# EAGLE design teensy36-audio-tft (EAGLE 8.0.2)
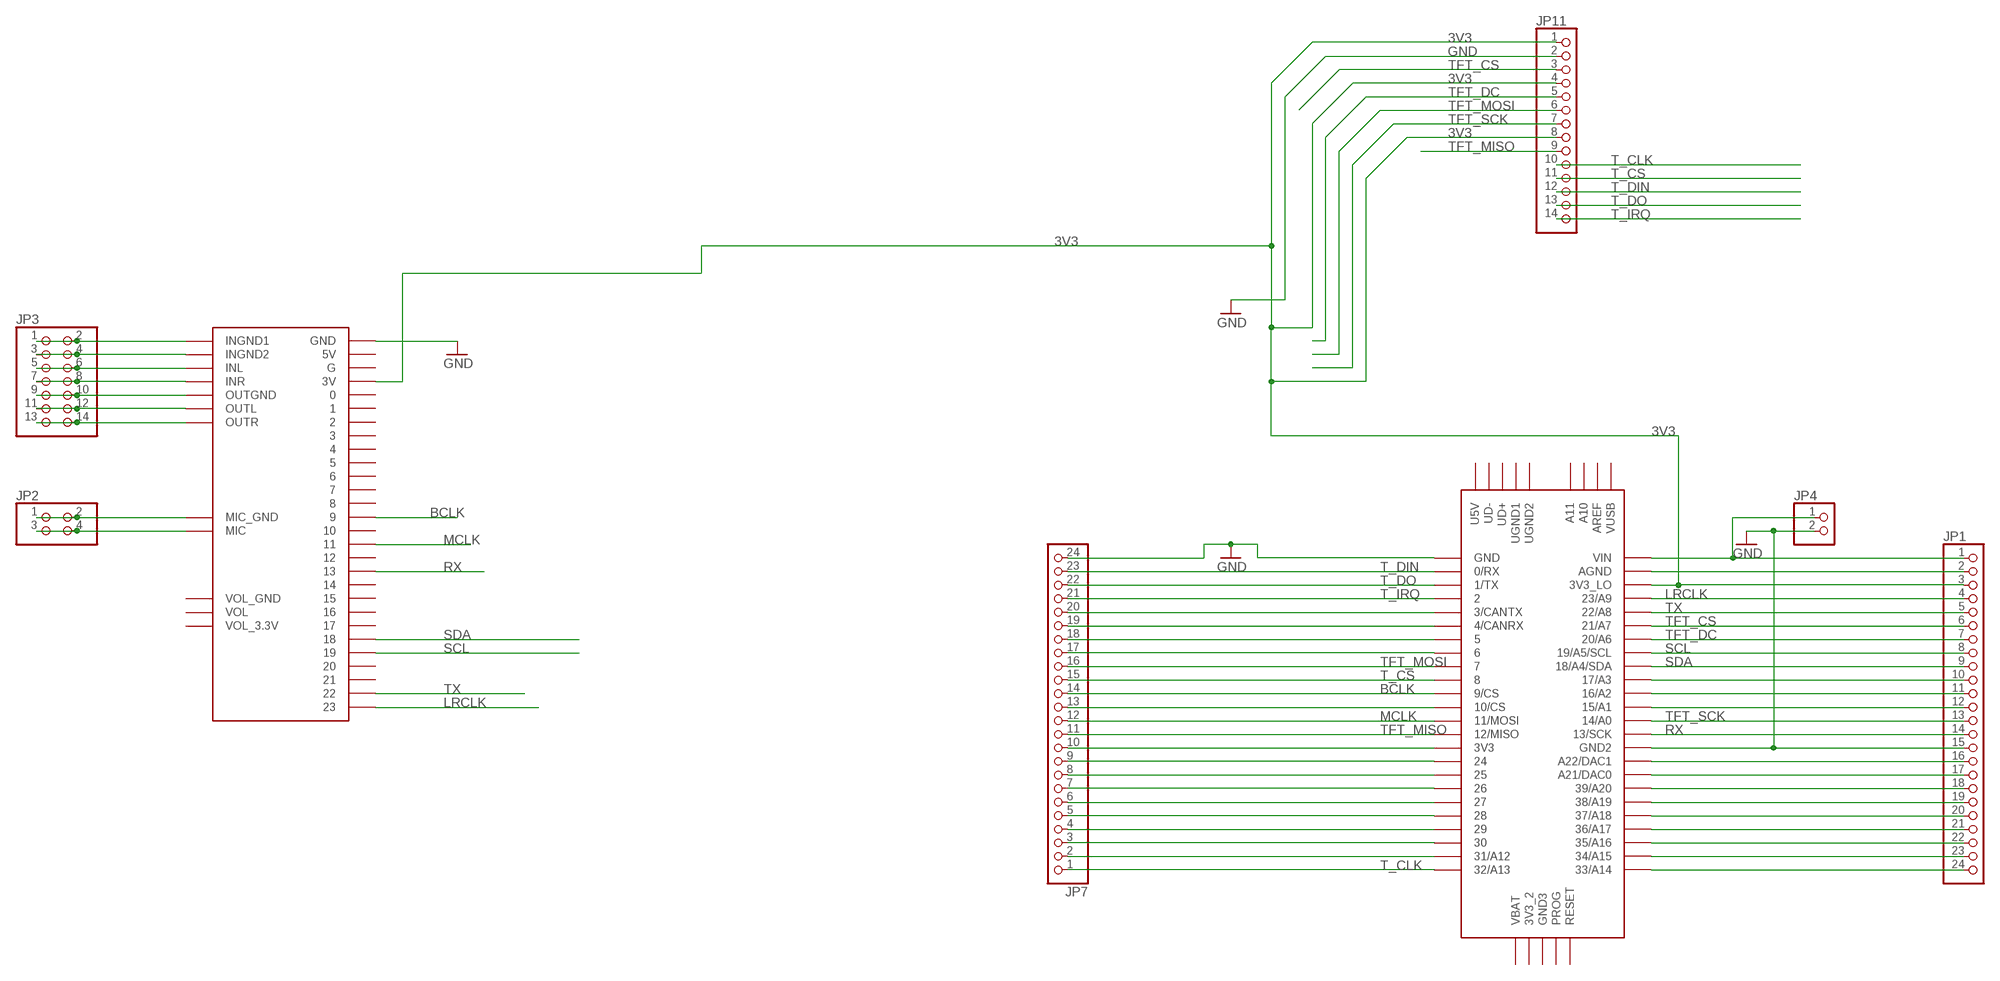
[diagram p0: schematic, sheet 1]

## Parts
JP1  PINHD-1X24  [1X24]
JP2  PINHD-2X2  [2X02]
JP3  PINHD-2X7  [2X07]
JP4  PINHD-1X2  [1X02]
JP7  PINHD-1X24  [1X24]
JP11  PINHD-1X14  [1X14]
U$2  AUDIOSHIELD  [AUDIOSHIELD]
U$3  TEENSY_3.5/3.6  [TEENSY_3.5/3.6]

## Nets
3V3: JP1.3 JP11.1 JP11.4 JP11.8 U$2.3V U$3.3V3_LO
BCLK: JP7.14 U$2.9 U$3.9/CS
GND: JP1.15 JP4.2 JP7.24 JP11.2 U$2.GND U$3.GND U$3.GND2
LRCLK: JP1.4 U$2.23 U$3.23/A9
MCLK: JP7.12 U$2.11 U$3.11/MOSI
N$1: JP2.1 JP2.2 U$2.GND_MIC(MIC_GND)
N$2: JP1.1 JP4.1 U$3.VIN
N$7: JP7.20 U$3.3/CANTX
N$8: JP7.19 U$3.4/CANRX
N$9: JP7.18 U$3.5
N$10: JP2.3 JP2.4 U$2.MIC
N$11: JP3.1 JP3.2 U$2.INGND1
N$12: JP3.3 JP3.4 U$2.INGND2
N$13: JP3.5 JP3.6 U$2.INL
N$14: JP3.7 JP3.8 U$2.INR
N$15: JP3.9 JP3.10 U$2.OUTGND
N$16: JP3.11 JP3.12 U$2.OUTL
N$17: JP3.13 JP3.14 U$2.OUTR
N$18: JP7.17 U$3.6
N$22: JP7.13 U$3.10/CS
N$25: JP7.10 U$3.3V3
N$26: JP7.9 U$3.24
N$27: JP7.8 U$3.25
N$28: JP7.7 U$3.26
N$29: JP7.6 U$3.27
N$30: JP7.5 U$3.28
N$31: JP7.4 U$3.29
N$32: JP7.3 U$3.30
N$33: JP7.2 U$3.31/A12
N$36: JP1.2 U$3.AGND
N$44: JP1.10 U$3.17/A3
N$45: JP1.11 U$3.16/A2
N$46: JP1.12 U$3.15/A1
N$50: JP1.16 U$3.A22/DAC1
N$51: JP1.17 U$3.21/DAC0(A21/DAC0)
N$52: JP1.18 U$3.39/A20
N$53: JP1.19 U$3.38/A19
N$54: JP1.20 U$3.37/A18
N$55: JP1.21 U$3.36/A17
N$56: JP1.22 U$3.35/A16
N$57: JP1.23 U$3.34/A15
N$58: JP1.24 U$3.33/A14
RX: JP1.14 U$2.13 U$3.13/SCK
SCL: JP1.8 U$2.19 U$3.19/A5/SCL
SDA: JP1.9 U$2.18 U$3.18/A4/SDA
T_CLK: JP7.1 JP11.10 U$3.32/A13
T_CS: JP7.15 JP11.11 U$3.8
T_DIN: JP7.23 JP11.12 U$3.0/RX
T_DO: JP7.22 JP11.13 U$3.1/TX
T_IRQ: JP7.21 JP11.14 U$3.2
TFT_CS: JP1.6 JP11.3 U$3.21/A7
TFT_DC: JP1.7 JP11.5 U$3.20/A6
TFT_MISO: JP7.11 JP11.9
TFT_MOSI: JP7.16 JP11.6 U$3.7
TFT_SCK: JP1.13 JP11.7 U$3.14/A0
TX: JP1.5 U$2.22 U$3.22/A8
Unconnected: U$2.0 U$2.1 U$2.2 U$2.3 U$2.4 U$2.5 U$2.5V U$2.6 U$2.7 U$2.8 U$2.10 U$2.12 U$2.14 U$2.15 U$2.16 U$2.17 U$2.20 U$2.21 U$2.G U$2.VOL U$2.VOL_3.3V U$2.VOL_GND U$3.3V3_2 U$3.12/MISO U$3.A10 U$3.A11 U$3.AREF U$3.GND3 U$3.PROG U$3.RESET U$3.U5V U$3.UD+ U$3.UD- U$3.UGND1 U$3.UGND2 U$3.VBAT U$3.VUSB

## Library data of the parts
JP1 JP7 = pinhead:PINHD-1X24: PIN HEADER
JP2 = pinhead:PINHD-2X2: PIN HEADER
JP3 = pinhead:PINHD-2X7: PIN HEADER
JP4 = pinhead:PINHD-1X2: PIN HEADER
JP11 = pinhead:PINHD-1X14: PIN HEADER
U$2 = Teensy_Audioshield:AUDIOSHIELD: Teensy 3 Audioshield by PJRC.COM
U$3 = JC_Teensy356:TEENSY_3.5/3.6

## Board
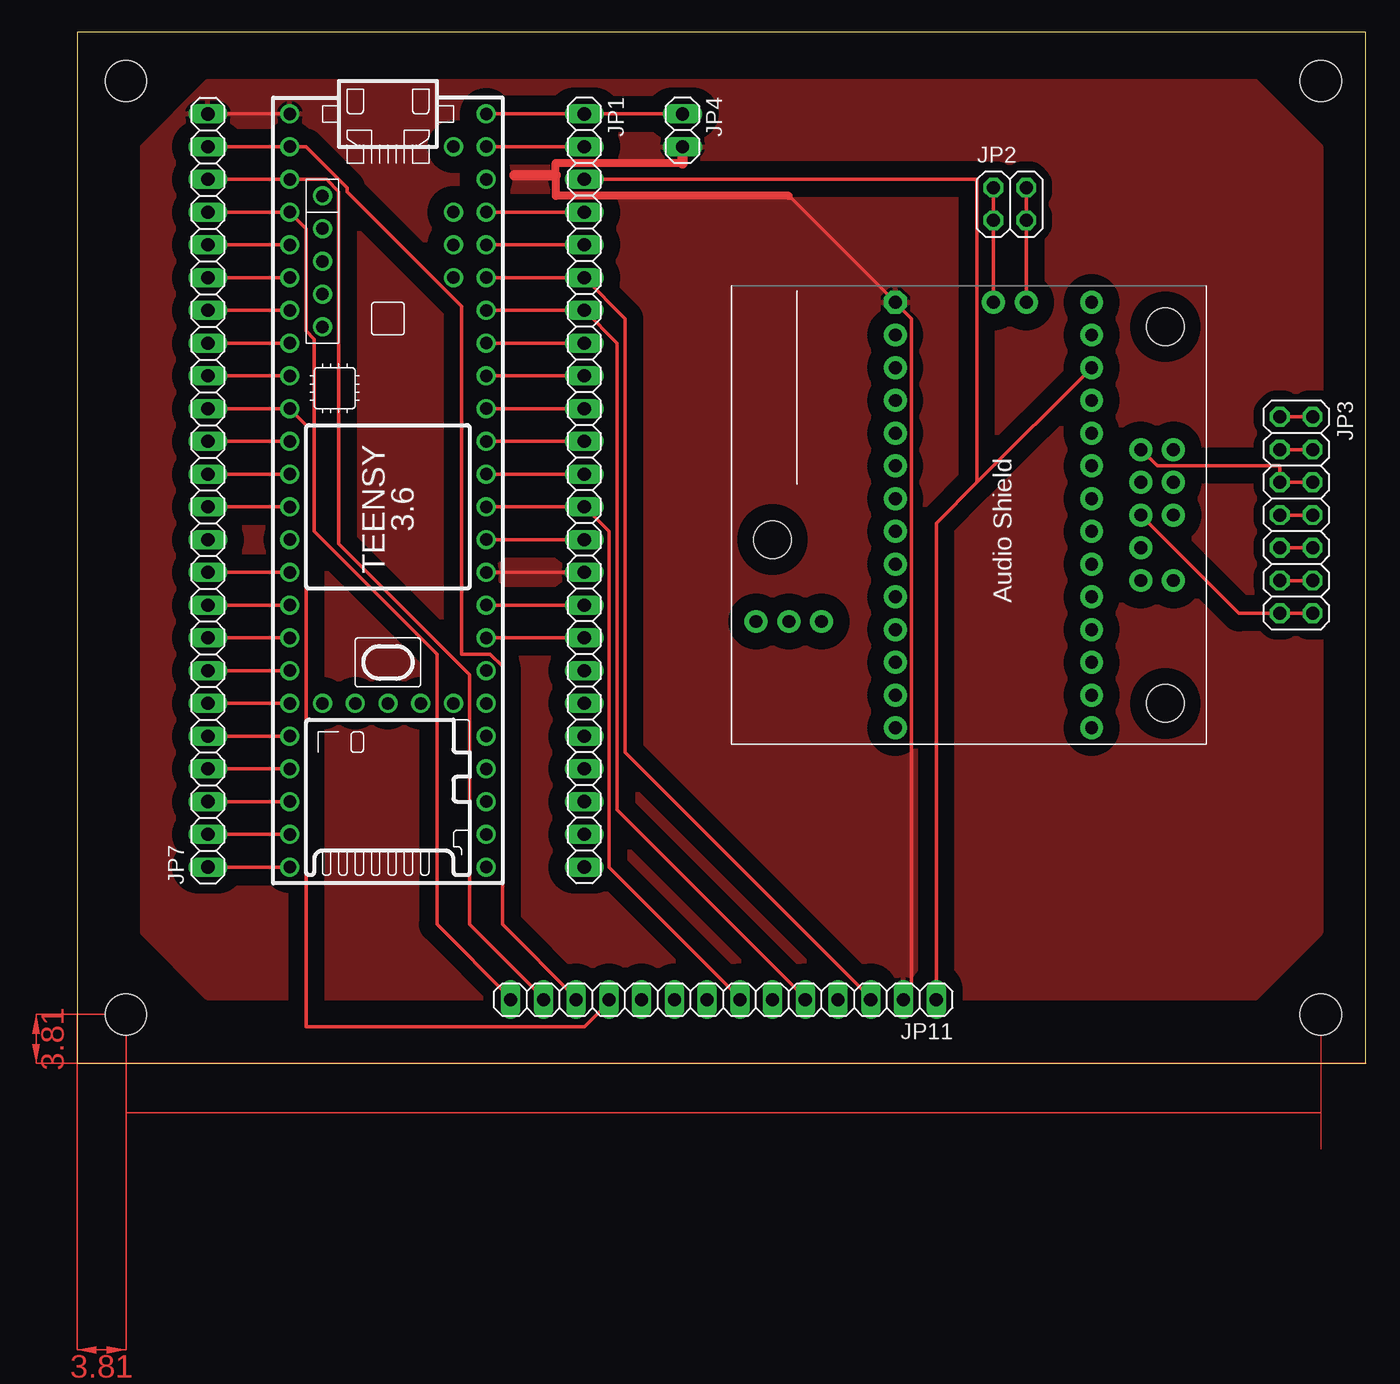
[diagram p1: board, top side]
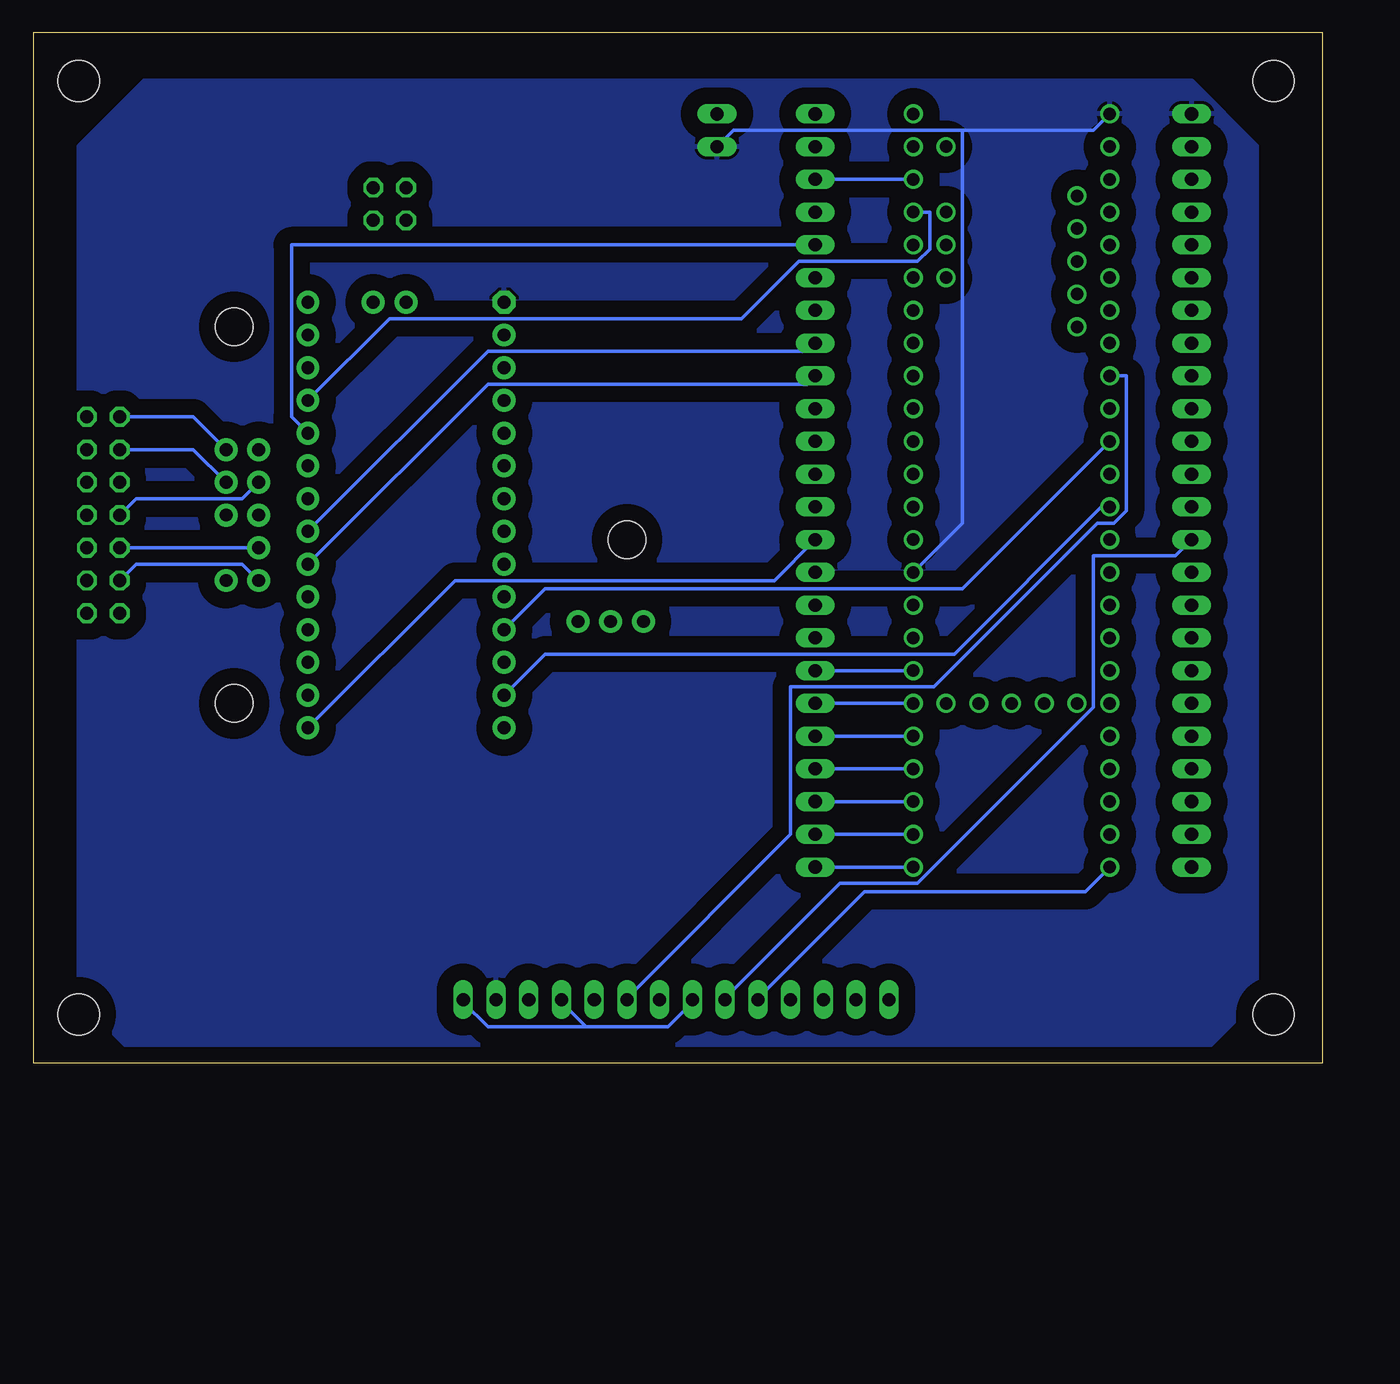
[diagram p2: board, bottom side, seen from below]

Size 100 x 80 mm. Coordinates in mm from the lower left corner, seen from the top.
Outline: 0,0 100,0 100,80 0,80 0,0
Copper layers (1*16): Top 0.035mm / dielectric 1.5mm / Bottom 0.035mm
Design rules "default": minimum track width 10mil, minimum drill 24mil, track to track 8mil, track to pad 8mil, pad to pad 8mil, via to via 8mil, smd to smd 8mil, copper to edge 40mil, drill to drill 8mil, minimum pad ring 10mil, minimum via ring 8mil, stop-mask expansion 4mil, vias tented up to drill 0mil, thermal gap 10mil
Holes 3.2 mm at 3.81,76.2 3.81,3.81 96.52,76.2 96.52,3.81

### Footprints (pad centres in the part's own frame; a part is rotated, then mirrored left to right if it is on the bottom)
1X24 = drill 1.016 long: 1 -29.21,0; 2 -26.67,0; 3 -24.13,0; 4 -21.59,0; 5 -19.05,0; 6 -16.51,0; 7 -13.97,0; 8 -11.43,0; 9 -8.89,0; 10 -6.35,0; 11 -3.81,0; 12 -1.27,0; 13 1.27,0; 14 3.81,0; 15 6.35,0; 16 8.89,0; 17 11.43,0; 18 13.97,0; 19 16.51,0; 20 19.05,0; 21 21.59,0; 22 24.13,0; 23 26.67,0; 24 29.21,0
2X02 = drill 1.016 octagon: 1 -1.27,-1.27; 2 -1.27,1.27; 3 1.27,-1.27; 4 1.27,1.27
2X07 = drill 1.016 octagon: 1 -7.62,-1.27; 2 -7.62,1.27; 3 -5.08,-1.27; 4 -5.08,1.27; 5 -2.54,-1.27; 6 -2.54,1.27; 7 0,-1.27; 8 0,1.27; 9 2.54,-1.27; 10 2.54,1.27; 11 5.08,-1.27; 12 5.08,1.27; 13 7.62,-1.27; 14 7.62,1.27
1X02 = drill 1.016 long: 1 -1.27,0; 2 1.27,0
1X14 = drill 1.016 long: 1 -16.51,0; 2 -13.97,0; 3 -11.43,0; 4 -8.89,0; 5 -6.35,0; 6 -3.81,0; 7 -1.27,0; 8 1.27,0; 9 3.81,0; 10 6.35,0; 11 8.89,0; 12 11.43,0; 13 13.97,0; 14 16.51,0
AUDIOSHIELD = drill 1 pad 1.778: 0 -13.97,-5.08; 1 -11.43,-5.08; 2 -8.89,-5.08; 3 -6.35,-5.08; 3V -11.43,10.16; 4 -3.81,-5.08; 5 -1.27,-5.08; 5V -16.51,10.16; 6 1.27,-5.08; 7 3.81,-5.08; 8 6.35,-5.08; 9 8.89,-5.08; 10 11.43,-5.08; 11 13.97,-5.08; 12 16.51,-5.08; 13 16.51,10.16; 14 13.97,10.16; 15 11.43,10.16; 16 8.89,10.16; 17 6.35,10.16; 18 3.81,10.16; 19 1.27,10.16; 20 -1.27,10.16; 21 -3.81,10.16; 22 -6.35,10.16; 23 -8.89,10.16; G -13.97,10.16; GND_MIC -16.51,2.54; INGND1 -5.08,16.51; INGND2 -2.54,16.51; INL -5.08,13.97; INR -2.54,13.97; MIC -16.51,5.08; OUTGND 2.54,13.97; OUTL 5.08,13.97; OUTR 0,13.97; UNUSED1 0,16.51; UNUSED2 5.08,16.51; VOL 8.255,-13.335; VOL_3.3V 8.255,-15.875; VOL_GND 8.255,-10.795 | drill 1 pad 1.778 octagon: GND -16.51,-5.08 | hole 2.921: 1.905,-14.605; -14.605,15.875; 14.605,15.875
TEENSY_3.5/3.6 = drill 0.965: 0/RX -25.4,-7.62; 1/TX -22.86,-7.62; 2 -20.32,-7.62; 3/CANTX -17.78,-7.62; 3V3 7.62,-7.62; 3V3_2 17.78,-2.54; 3V3_LO -22.86,7.62; 4/CANRX -15.24,-7.62; 5 -12.7,-7.62; 6 -10.16,-7.62; 7 -7.62,-7.62; 8 -5.08,-7.62; 9/CS -2.54,-7.62; 10/CS 0,-7.62; 11/MOSI 2.54,-7.62; 12/MISO 5.08,-7.62; 13/SCK 5.08,7.62; 14/A0 2.54,7.62; 15/A1 0,7.62; 16/A2 -2.54,7.62; 17/A3 -5.08,7.62; 18/A4/SDA -7.62,7.62; 19/A5/SCL -10.16,7.62; 20/A6 -12.7,7.62; 21/A7 -15.24,7.62; 21/DAC0 12.7,7.62; 22/A8 -17.78,7.62; 23/A9 -20.32,7.62; 24 10.16,-7.62; 25 12.7,-7.62; 26 15.24,-7.62; 27 17.78,-7.62; 28 20.32,-7.62; 29 22.86,-7.62; 30 25.4,-7.62; 31/A12 27.94,-7.62; 32/A13 30.48,-7.62; 33/A14 30.48,7.62; 34/A15 27.94,7.62; 35/A16 25.4,7.62; 36/A17 22.86,7.62; 37/A18 20.32,7.62; 38/A19 17.78,7.62; 39/A20 15.24,7.62; A10 -17.78,5.08; A11 -15.24,5.08; A22/DAC1 10.16,7.62; AGND -25.4,7.62; AREF -20.32,5.08; GND -27.94,-7.62; GND2 7.62,7.62; GND3 17.78,0; PROG 17.78,2.54; RESET 17.78,5.08; U5V -21.59,-5.08; UD+ -16.51,-5.08; UD- -19.05,-5.08; UGND1 -13.97,-5.08; UGND2 -11.43,-5.08; VBAT 17.78,-5.08; VIN -27.94,7.62; VUSB -25.4,5.08

### Placement (x,y rotation side)
JP1  39.37,44.45 270 top
JP2  72.39,66.67 0 top
JP3  94.61,42.55 270 top
JP4  46.99,72.39 270 top
JP7  10.16,44.45 90 top
JP11  50.16,4.95 180 top
U$2  68.58,42.55 270 top
U$3  24.13,45.72 270 top

### Tracks (layer width: path | path; a pad name or v marks a point on that pad's centre or on a via)
3V3
  Top 0.254: 69.85,45.09 66.67,41.91 JP11.1 | 69.85,45.09 U$2.3V | JP1.3 69.85,68.58 69.85,45.09
  Bottom 0.254: JP1.3 U$3.3V3_LO | 57.15,2.86 50.8,2.86 48.9,4.76 JP11.8 | 57.15,2.86 59.05,4.76 JP11.4 | 57.15,2.86 64.77,2.86 66.67,4.76 JP11.1
BCLK
  Top 0.254: JP7.14 U$3.9/CS
  Bottom 0.254: U$2.9 60.33,36.83 27.94,36.83 U$3.9/CS
GND
  Top 0.254: JP11.2 64.14,5.08 64.77,5.71 64.77,57.78 U$2.GND 55.24,67.31 | JP1.15 U$3.GND2 | JP7.24 U$3.GND
  Top 0.406: 37.15,67.31 37.15,68.26 | 37.15,68.26 37.15,68.58 | 37.15,68.26 37.15,68.9
  Top 0.61: 55.24,67.31 37.15,67.31 37.15,68.26 37.15,68.58 37.15,68.9 37.15,69.85 46.99,69.85
  Top 0.813: JP4.2 46.99,69.85 | 37.15,68.9 33.97,68.9
  Bottom 0.254: JP4.2 45.72,72.39 27.94,72.39 | 27.94,72.39 17.78,72.39 U$3.GND | U$3.GND2 27.94,41.91 27.94,72.39
  pour Bottom (isolate 1.27): 5.08,71.12 10.16,76.2 91.44,76.2 96.52,71.12 96.52,10.16 96.52,5.08 91.44,0 10.16,0 5.08,5.08
  pour Top (isolate 1.27): 5.08,71.12 10.16,76.2 91.44,76.2 96.52,71.12 96.52,10.16 91.44,5.08 10.16,5.08 5.08,10.16
LRCLK
  Top 0.254: JP1.4 U$3.23/A9
  Bottom 0.254: U$2.23 72.39,57.78 45.09,57.78 40.64,62.23 31.43,62.23 30.48,63.18 30.48,66.04 U$3.23/A9
MCLK
  Top 0.254: JP7.12 U$3.11/MOSI
  Bottom 0.254: U$2.11 60.33,31.75 28.57,31.75 17.14,43.18 U$3.11/MOSI
N$1
  Top 0.254: JP2.2 JP2.1 U$2.GND_MIC
N$2
  Top 0.254: U$3.VIN JP1.1 JP4.1
N$3
  Top 0: 3.81,3.81 3.81,-3.81
N$4
  Top 0: 96.52,3.81 96.52,-6.67
N$7
  Top 0.254: JP7.20 U$3.3/CANTX
N$8
  Top 0.254: JP7.19 U$3.4/CANRX
N$9
  Top 0.254: JP7.18 U$3.5
N$10
  Top 0.254: JP2.4 JP2.3 U$2.MIC
N$11
  Top 0.254: JP3.2 JP3.1
  Bottom 0.254: U$2.INGND1 87.63,50.16 JP3.1
N$12
  Top 0.254: JP3.4 JP3.3
  Bottom 0.254: U$2.INGND2 87.63,47.62 JP3.3
N$13
  Top 0.254: JP3.6 JP3.5 93.34,46.35 83.82,46.35 U$2.INL
N$14
  Top 0.254: JP3.8 JP3.7
  Bottom 0.254: U$2.INR 83.82,43.81 92.08,43.81 JP3.7
N$15
  Top 0.254: JP3.10 JP3.9
  Bottom 0.254: JP3.9 U$2.OUTGND
N$16
  Top 0.254: JP3.12 JP3.11
  Bottom 0.254: U$2.OUTL 83.82,38.73 92.08,38.73 JP3.11
N$17
  Top 0.254: JP3.14 JP3.13 90.17,34.92 U$2.OUTR
N$18
  Top 0.254: JP7.17 U$3.6
N$22
  Top 0.254: JP7.13 U$3.10/CS
N$25
  Top 0.254: JP7.10 U$3.3V3
N$26
  Top 0.254: JP7.9 U$3.24
N$27
  Top 0.254: JP7.8 U$3.25
N$28
  Top 0.254: JP7.7 U$3.26
N$29
  Top 0.254: JP7.6 U$3.27
N$30
  Top 0.254: JP7.5 U$3.28
N$31
  Top 0.254: JP7.4 U$3.29
N$32
  Top 0.254: JP7.3 U$3.30
N$33
  Top 0.254: JP7.2 U$3.31/A12
N$36
  Top 0.254: JP1.2 U$3.AGND
N$44
  Top 0.254: JP1.10 U$3.17/A3
N$45
  Top 0.254: JP1.11 U$3.16/A2
N$46
  Top 0.254: JP1.12 U$3.15/A1
N$50
  Top 0.254: JP1.16 U$3.A22/DAC1
N$51
  Top 0.254: JP1.17 U$3.21/DAC0
N$52
  Bottom 0.254: JP1.18 U$3.39/A20
N$53
  Bottom 0.254: JP1.19 U$3.38/A19
N$54
  Bottom 0.254: JP1.20 U$3.37/A18
N$55
  Bottom 0.254: JP1.21 U$3.36/A17
N$56
  Bottom 0.254: JP1.22 U$3.35/A16
N$57
  Bottom 0.254: JP1.23 U$3.34/A15
N$58
  Bottom 0.254: JP1.24 U$3.33/A14
RX
  Top 0.254: JP1.14 U$3.13/SCK
  Bottom 0.254: U$2.13 67.31,37.47 42.55,37.47 JP1.14
SCL
  Top 0.254: JP1.8 U$3.19/A5/SCL
  Bottom 0.254: U$2.19 64.77,55.24 40.01,55.24 JP1.8
SDA
  Top 0.254: JP1.9 U$3.18/A4/SDA
  Bottom 0.254: U$2.18 64.77,52.7 40.01,52.7 JP1.9
T_CLK
  Top 0.254: JP7.1 U$3.32/A13
  Bottom 0.254: U$3.32/A13 18.41,13.34 35.56,13.34 43.81,5.08 JP11.10
T_CS
  Top 0.254: JP7.15 U$3.8 17.78,49.53 17.78,2.86 39.37,2.86 41.27,4.76 JP11.11
T_DIN
  Top 0.254: JP7.23 U$3.0/RX 17.78,71.12 20.95,67.94 20.95,67.63 29.84,58.74 29.84,31.75 32.07,31.75 33.02,30.8 33.02,10.79 38.73,5.08 JP11.12
T_DO
  Top 0.254: JP7.22 U$3.1/TX 19.37,68.58 20.32,67.63 20.32,40.32 30.48,30.16 30.48,10.79 36.2,5.08 JP11.13
T_IRQ
  Top 0.254: JP7.21 U$3.2 17.78,64.77 17.78,56.83 18.41,56.2 18.41,41.27 27.94,31.75 27.94,10.79 33.66,5.08 JP11.14
TFT_CS
  Top 0.254: U$3.21/A7 JP1.6 42.55,57.78 42.55,24.13 61.59,5.08 JP11.3
TFT_DC
  Top 0.254: U$3.20/A6 JP1.7 41.91,55.88 41.91,19.68 56.52,5.08 JP11.5
TFT_MISO
  Bottom 0.254: JP7.11 11.43,39.37 17.78,39.37 17.78,27.62 31.43,13.97 37.47,13.97 46.35,5.08 JP11.9
TFT_MOSI
  Top 0.254: JP7.16 U$3.7
  Bottom 0.254: U$3.7 15.24,53.34 15.24,42.86 16.19,41.91 17.46,41.91 30.16,29.21 41.27,29.21 41.27,17.78 53.98,5.08 JP11.6
TFT_SCK
  Top 0.254: U$3.14/A0 JP1.13 41.27,41.27 41.27,15.24 51.44,5.08 JP11.7
TX
  Top 0.254: JP1.5 U$3.22/A8
  Bottom 0.254: U$2.22 80.01,50.16 80.01,63.5 JP1.5
(copper drawn outside any net)
  shapes: Top area x5